# EAGLE design Cup_and_Wash_v2 (EAGLE 8.5.1)

## Sheet 1 of 2: Inputs
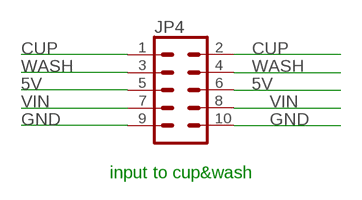
[diagram p0: schematic, sheet 1]

### Parts
JP4  CONN_05X2PTH  [2X5]

### Nets
5V: JP4.5 JP4.6 ; also sheet 2
CUP: JP4.1 JP4.2 ; also sheet 2
GND: JP4.9 JP4.10 ; also sheet 2
VIN: JP4.7 JP4.8 ; also sheet 2
WASH: JP4.3 JP4.4 ; also sheet 2

### Notes on the sheet
- input to cup&wash

## Sheet 2 of 2: timers and outputs
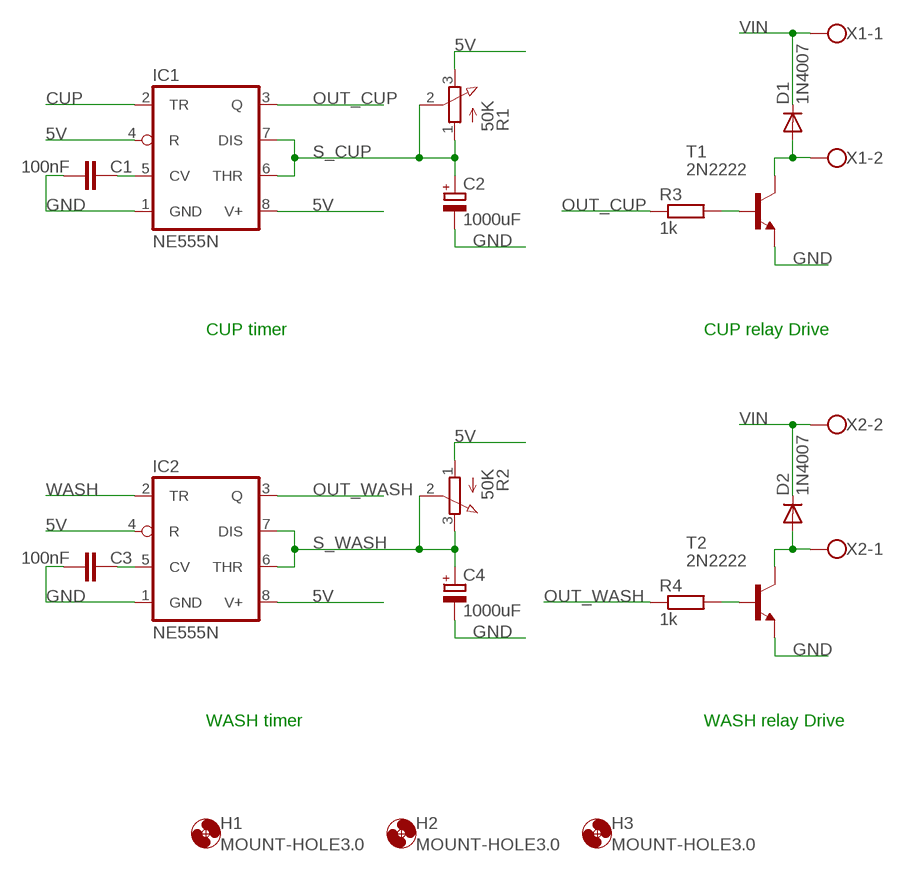
[diagram p1: schematic, sheet 2]

### Parts
C1  100nF  C-EU050-025X075  [C050-025X075]
C2  1000uF  CPOL-EUE5-13  [E5-13]
C3  100nF  C-EU050-025X075  [C050-025X075]
C4  1000uF  CPOL-EUE5-13  [E5-13]
D1  1N4007  1N4004  [DO41-10]
D2  1N4007  1N4004  [DO41-10]
H1  MOUNT-HOLE3.0  [3,0]
H2  MOUNT-HOLE3.0  [3,0]
H3  MOUNT-HOLE3.0  [3,0]
IC1  NE555N  [DIL08-ROUND]
IC2  NE555N  [DIL08-ROUND]
R1  50K  3RP/1610N  [3RP/1610N]
R2  50K  3RP/1610N  [3RP/1610N]
R3  1k  R-EU_0207/10  [0207/10]
R4  1k  R-EU_0207/10  [0207/10]
T1  2N2222  [TO92-EBC-OVAL]
T2  2N2222  [TO92-EBC-OVAL]
X1  W237-102  [W237-102]
X2  W237-102  [W237-102]

### Nets
5V: IC1.4(R) IC1.8(V+) IC2.4(R) IC2.8(V+) R1.3(E) R2.1(A) ; also sheet 1
CUP: IC1.2(TR) ; also sheet 1
GND: C1.2 C2.- C3.2 C4.- IC1.1(GND) IC2.1(GND) T1.E T2.E ; also sheet 1
N$1: D1.A T1.C X1.2
N$2: C1.1 IC1.5(CV)
N$3: C3.1 IC2.5(CV)
N$4: D2.A T2.C X2.1
N$5: R3.2 T1.B
N$6: R4.2 T2.B
OUT_CUP: IC1.3(Q) R3.1
OUT_WASH: IC2.3(Q) R4.1
S_CUP: C2.+ IC1.6(THR) IC1.7(DIS) R1.1(A) R1.2(S)
S_WASH: C4.+ IC2.6(THR) IC2.7(DIS) R2.2(S) R2.3(E)
VIN: D1.C D2.C X1.1 X2.2 ; also sheet 1
WASH: IC2.2(TR) ; also sheet 1

### Notes on the sheet
- CUP timer | CUP relay Drive
- WASH timer | WASH relay Drive

## Library data of the parts
C1 C3 = rcl:C-EU: CAPACITOR, European symbol; SPICEPREFIX: C
C2 C4 = rcl:CPOL-EU: POLARIZED CAPACITOR, European symbol; SPICEPREFIX: C
D1 D2 = adafruit:1N4004: DIODE General purpose 1N400x type rectifier (With bigger pads) http://www.ladyada.net/library/pcb/eaglelibrary.html
H1-H3 = holes:MOUNT-HOLE: MOUNTING HOLE with drill center marker
IC1 IC2 = adafruit:*555: TIMER Changed DIP package to have round (not oval) pin pads http://www.ladyada.net/library/pcb/eaglelibrary.html
JP4 = SparkFun-Connectors:CONN_05X2: Multi connection point. Often used as Generic Header-pin footprint for 0.1 inch spaced/style header connections For AVR SPI programming port, see special device with nice symbol: "AVR_SPI_PROG_5x2.dev" You can populate with any combo of single row headers, but if you'd like an exact match, check these: 2x5 AVR ICSP Male Header <https://www.sparkfun.com/products/778> (PRT-00778) 2x5 Pin Shrouded Header <https://www.sparkfun.com/products/8506> (PRT-08506) On any of the 0.1 inch spaced packages, you can populate with these: Break Away Headers - Straight <https://www.sparkfun.com/products/116> (PRT-00116) Break Away Male Headers - Right Angle <https://www.sparkfun.com/products/553> (PRT-00553) Female Headers <https://www.sparkfun.com/products/115> (PRT-00115) Break Away Headers - Machine Pin <https://www.sparkfun.com/products/117> (PRT-00117) Break Away Female Headers - Swiss Machine Pin <https://www.sparkfun.com/products/743> (PRT-00743) Special note: the shrouded connector mates well with our 5x2 ribbon cables: 2x5 Pin IDC Ribbon Cable <https://www.sparkfun.com/products/8535> (PRT-08535); PROD_ID: CONN-08499; SF_ID: PRT-0778
R1 R2 = pot:3RP/1610N: 16mm Potentiometer one level Source: http://www.alphapotentiometers.net/html/16mm_pot_2.html
R3 R4 = rcl-2:R-EU_: RESISTOR, European symbol
T1 T2 = adafruit:2N2222: NPN TRANSISTOR Big oval pads
X1 X2 = con-wago-500:W237-102: WAGO SCREW CLAMP; MPN: 237-102; OC_FARNELL: unknown; OC_NEWARK: 70K9898

## Board
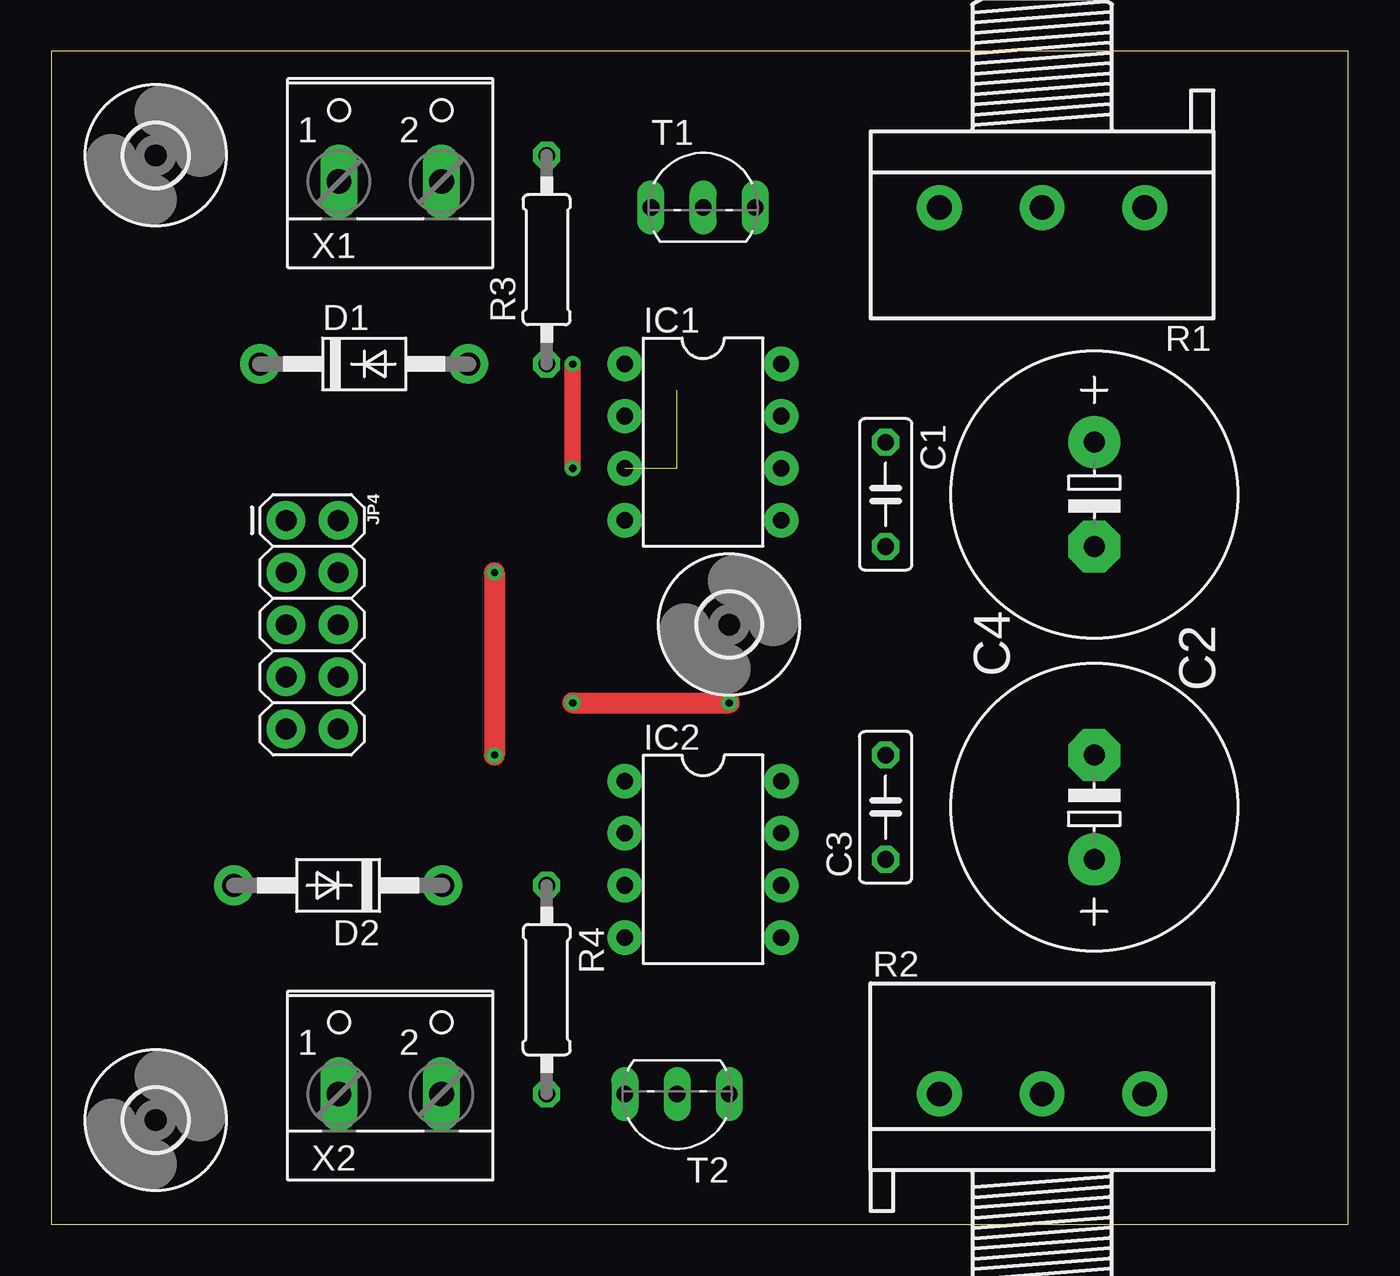
[diagram p2: board, top side]
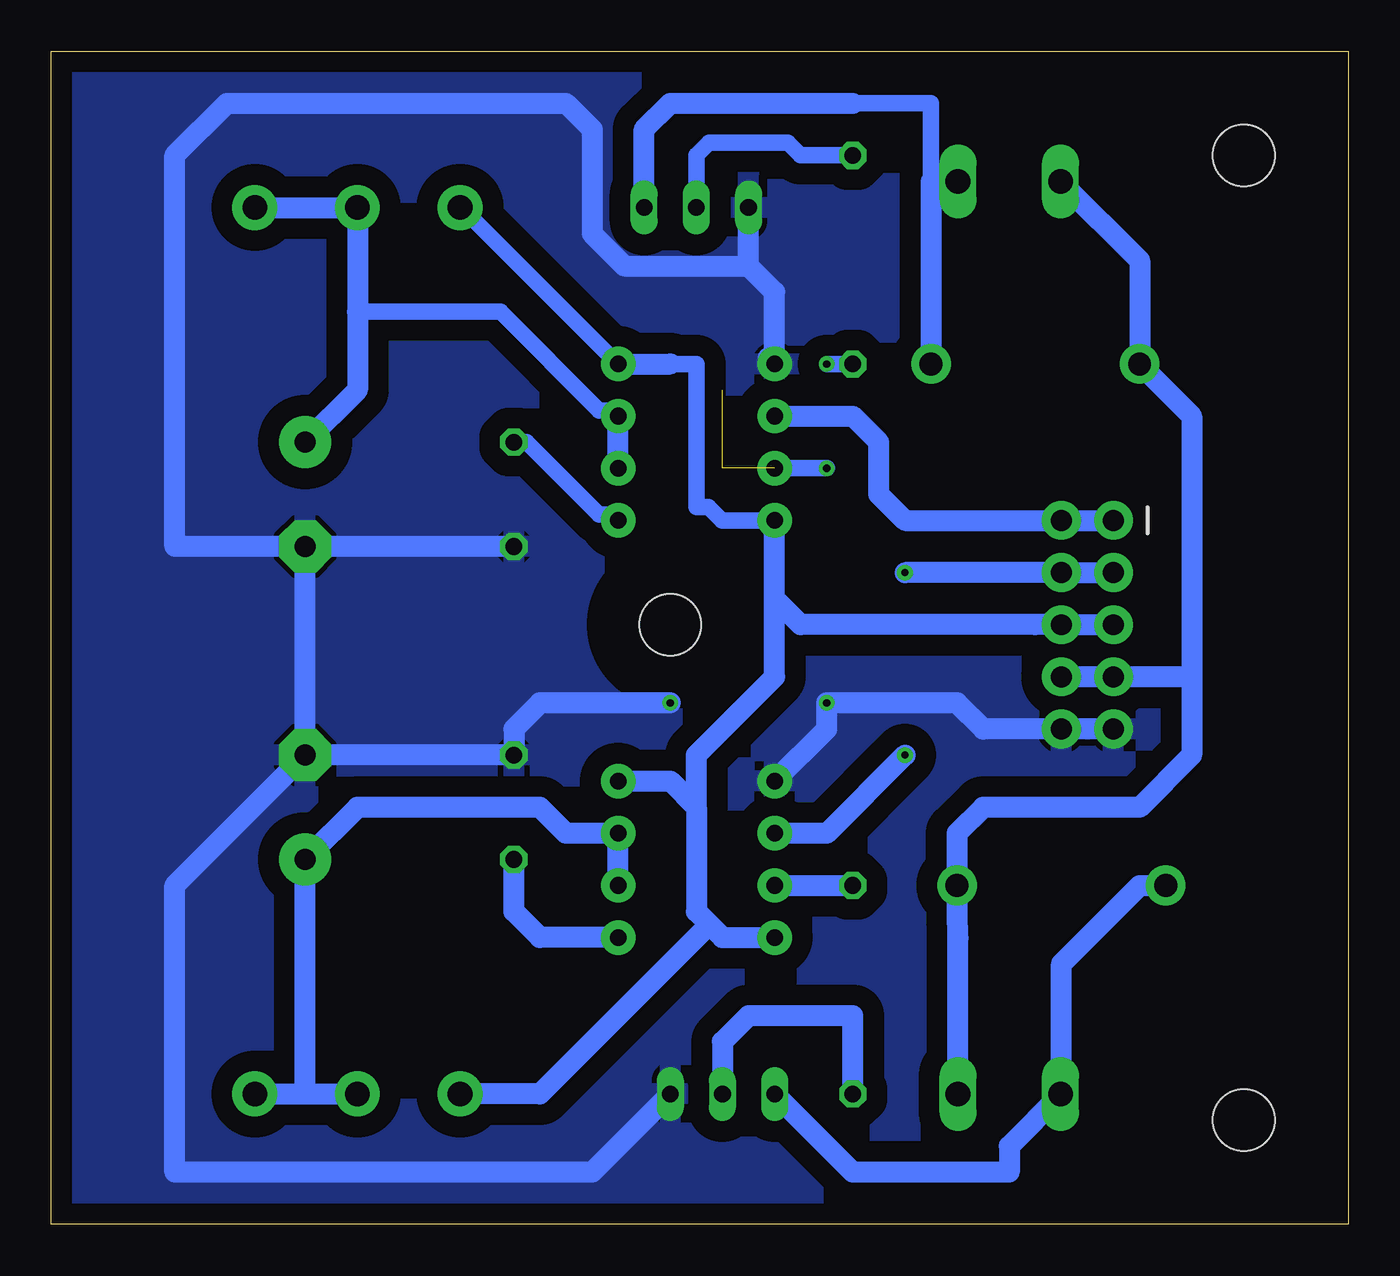
[diagram p3: board, bottom side, seen from below]

Size 63.17 x 57.14 mm. Coordinates in mm from the lower left corner, seen from the top.
Outline: 0,0 63.17,0 63.17,57.14 0,57.14 0,0
Copper layers (1*16): Top 0.035mm / dielectric 1.5mm / Bottom 0.035mm
Design rules "default *": minimum track width 6mil, minimum drill 0.35mm, track to track 40mil, track to pad 40mil, pad to pad 6mil, via to via 6mil, smd to smd 6mil, copper to edge 40mil, drill to drill 6mil, minimum pad ring 10mil, minimum via ring 8mil, stop-mask expansion 4mil, vias tented up to drill 0mil, thermal gap 10mil

### Footprints (pad centres in the part's own frame; a part is rotated, then mirrored left to right if it is on the bottom)
C050-025X075 = drill 0.813 octagon: 1 -2.54,0; 2 2.54,0
E5-13 = drill 1.016 pad 2.54: + -2.54,0 | drill 1.016 pad 2.54 octagon: - 2.54,0
DO41-10 = drill 1.118 pad 1.93: A 5.08,0; C -5.08,0
3,0 = hole 3: 0,0
DIL08-ROUND = drill 0.813 pad 1.676: 1 -3.81,-3.81; 2 -1.27,-3.81; 3 1.27,-3.81; 4 3.81,-3.81; 5 3.81,3.81; 6 1.27,3.81; 7 -1.27,3.81; 8 -3.81,3.81
2X5 = drill 1.016 pad 1.88: 1 0,0; 2 0,2.54; 3 2.54,0; 4 2.54,2.54; 5 5.08,0; 6 5.08,2.54; 7 7.62,0; 8 7.62,2.54; 9 10.16,0; 10 10.16,2.54
3RP/1610N = drill 1.2 pad 2.184: 1 -5,0; 2 0,0; 3 5,0
0207/10 = drill 0.813 octagon: 1 -5.08,0; 2 5.08,0
TO92-EBC-OVAL = drill 0.813 long: B 0,-1.27; C 2.54,-1.27; E -2.54,-1.27
W237-102 = drill 1.194 long: 1 -2.5,-1.27; 2 2.5,-1.27

### Placement (x,y rotation side)
C1  40.64,35.56 270 top
C2  50.8,35.56 270 top
C3  40.64,20.32 90 top
C4  50.8,20.32 90 top
D1  15.24,41.91 0 top
D2  13.97,16.51 180 top
H1  33.02,29.21 0 top
H2  5.08,5.08 0 top
H3  5.08,52.07 0 top
IC1  31.75,38.1 270 top
IC2  31.75,17.78 270 top
JP4  11.43,34.29 270 top
R1  48.26,49.53 180 top
R2  48.26,6.35 0 top
R3  24.13,46.99 90 top
R4  24.13,11.43 270 top
T1  31.75,50.8 0 top
T2  30.48,5.08 180 top
X1  16.51,52.07 0 top
X2  16.51,7.62 0 top

### Tracks (layer width: path | path; a pad name or v marks a point on that pad's centre or on a via)
5V
  Bottom 0.813: IC1.8 43.18,49.53 | 33.02,41.91 31.75,41.91 31.75,34.95 31.17,34.95 30.51,34.29 IC1.4
  Bottom 1.016: IC1.8 33.02,41.91 | 43.18,49.53 R1.3 | JP4.6 JP4.5 | 27.94,30.48 IC1.4 | IC2.8 33.02,21.59 31.75,20.32 | 31.75,20.32 31.75,15.24 31.12,14.61 | 31.12,14.61 30.48,13.97 IC2.4 | 31.12,14.61 39.37,6.35 R2.1 | JP4.6 15.24,29.21 | JP4.6 26.67,29.21 27.94,30.48 | 31.75,20.32 31.75,22.86 27.94,26.67 27.94,30.48
CUP
  Bottom 1.016: IC1.2 24.13,39.37 22.86,38.1 22.86,35.56 21.59,34.29 JP4.2 JP4.1
GND  (via drill 0.35)
  Top 1.016: v25.4,25.4 v33.02,25.4
  Bottom 1.016: C1.2 C2.- | JP4.9 JP4.10 17.78,24.13 19.05,25.4 v25.4,25.4 25.4,24.13 IC2.1 | C4.- C3.2 40.64,24.13 39.37,25.4 v33.02,25.4 | C4.- C2.- | C4.- 57.15,16.51 57.15,2.54 36.83,2.54 T2.E | C2.- 57.15,33.02 57.15,52.07 54.61,54.61 38.1,54.61 36.83,53.34 36.83,48.26 35.26,46.69 29.21,46.69 | 28.24,42.22 IC1.1 27.94,45.41 29.21,46.69 | 29.21,46.69 T1.E
  pour Bottom: 0,57.15 63.5,57.15 63.5,0 0,0
N$1
  Bottom 0.813: 24.13,54.61 20.32,54.61 20.32,50.8
  Bottom 1.016: T1.C 34.29,53.34 33.02,54.61 24.13,54.61 | X1.2 20.32,50.8 D1.A
N$2
  Bottom 0.813: IC1.5 35.84,34.57 36.5,34.57 40.03,38.1 C1.1
N$3
  Bottom 1.016: IC2.5 39.37,13.97 40.64,15.24 C3.1
N$4
  Bottom 1.016: 13.97,6.35 16.51,3.81 16.51,2.54 24.13,2.54 T2.C | 13.97,6.35 X2.1 | 13.97,6.35 13.97,12.7 10.16,16.51 D2.A
N$5
  Bottom 0.813: R3.2 26.67,52.07 27.28,52.68 31.14,52.68 31.75,52.07 T1.B
N$6
  Bottom 1.016: R4.2 24.13,10.16 29.21,10.16 30.48,8.89 T2.B
OUT_CUP  (via drill 0.35)  (2 unrouted)
  Top 0.813: v25.4,36.83 v25.4,41.91
  Bottom 0.813: IC1.3 v25.4,36.83 | v25.4,41.91 R3.1
OUT_WASH
  Bottom 1.016: IC2.3 R4.1
S_CUP
  Bottom 0.813: IC1.7 35.84,39.65 36.5,39.65 41.3,44.45 48.26,44.45
  Bottom 1.016: C2.+ 48.26,40.64 48.26,44.45 R1.2 R1.1 | IC1.6 IC1.7
S_WASH
  Bottom 1.016: IC2.6 IC2.7 38.1,19.05 39.37,20.32 48.26,20.32 C4.+ | C4.+ 50.72,17.7 | R2.3 50.8,6.35 | 50.8,6.35 R2.2 | 50.8,6.35 C4.+
VIN
  Bottom 1.016: X1.1 10.16,46.95 D1.C 7.62,39.37 7.62,26.67 | JP4.8 JP4.7 7.62,26.67 | X2.2 19.01,13.93 D2.C 19.05,19.05 17.78,20.32 10.16,20.32 7.62,22.86 7.62,26.67
WASH  (via drill 0.35)
  Top 1.016: v21.59,31.75 v21.59,22.86
  Bottom 1.016: JP4.3 JP4.4 v21.59,31.75 | v21.59,22.86 25.4,19.05 IC2.2